# Altium schematic sheet LED_Example_v24.1.2.SchDoc
size A4
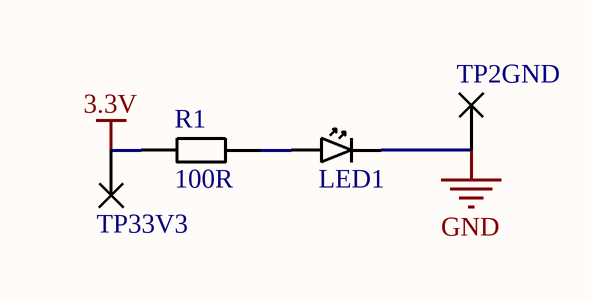
[diagram p0: LED_Example_v24.1.2.SchDoc]

## Parts
LED1  LED (0603) orange AEC-Q101  [0603 (LED)]  (value not drawn)
R1  value 100R  [R0402]  (hidden comment: 100R (0402))
TP2  GND
TP3  3V3

## Nets
3.3V: R1.1 TP3.1
GND: LED1.K TP2.1
NetLED1_A: LED1.A R1.2

## Library data of the parts
LED1 = LED (0603) orange AEC-Q101: LED orange 20mA AEC-Q101; Fabricant: ROHM; Référence: SML-D15DWT86C; Value: SML-D15DWT86C
R1 = 100R (0402): 1% 0402 0.063W 100ppm; Fabricant: MULTICOMP; Référence: MCWR04X1000FTL
TP2 TP3 = Pad